# EasyEDA Pro project ProDocument_大功率降压DCDC_2023-12-31.epro

# Schematic Schematic12
Create Date: 2023-12-13; Page Name: P1; Project Name: Multimeter; Schematic Name: Schematic12; Update Date: 2023-12-13; Company: 嘉立创EDA; Page Size: A4; Version: V1.0
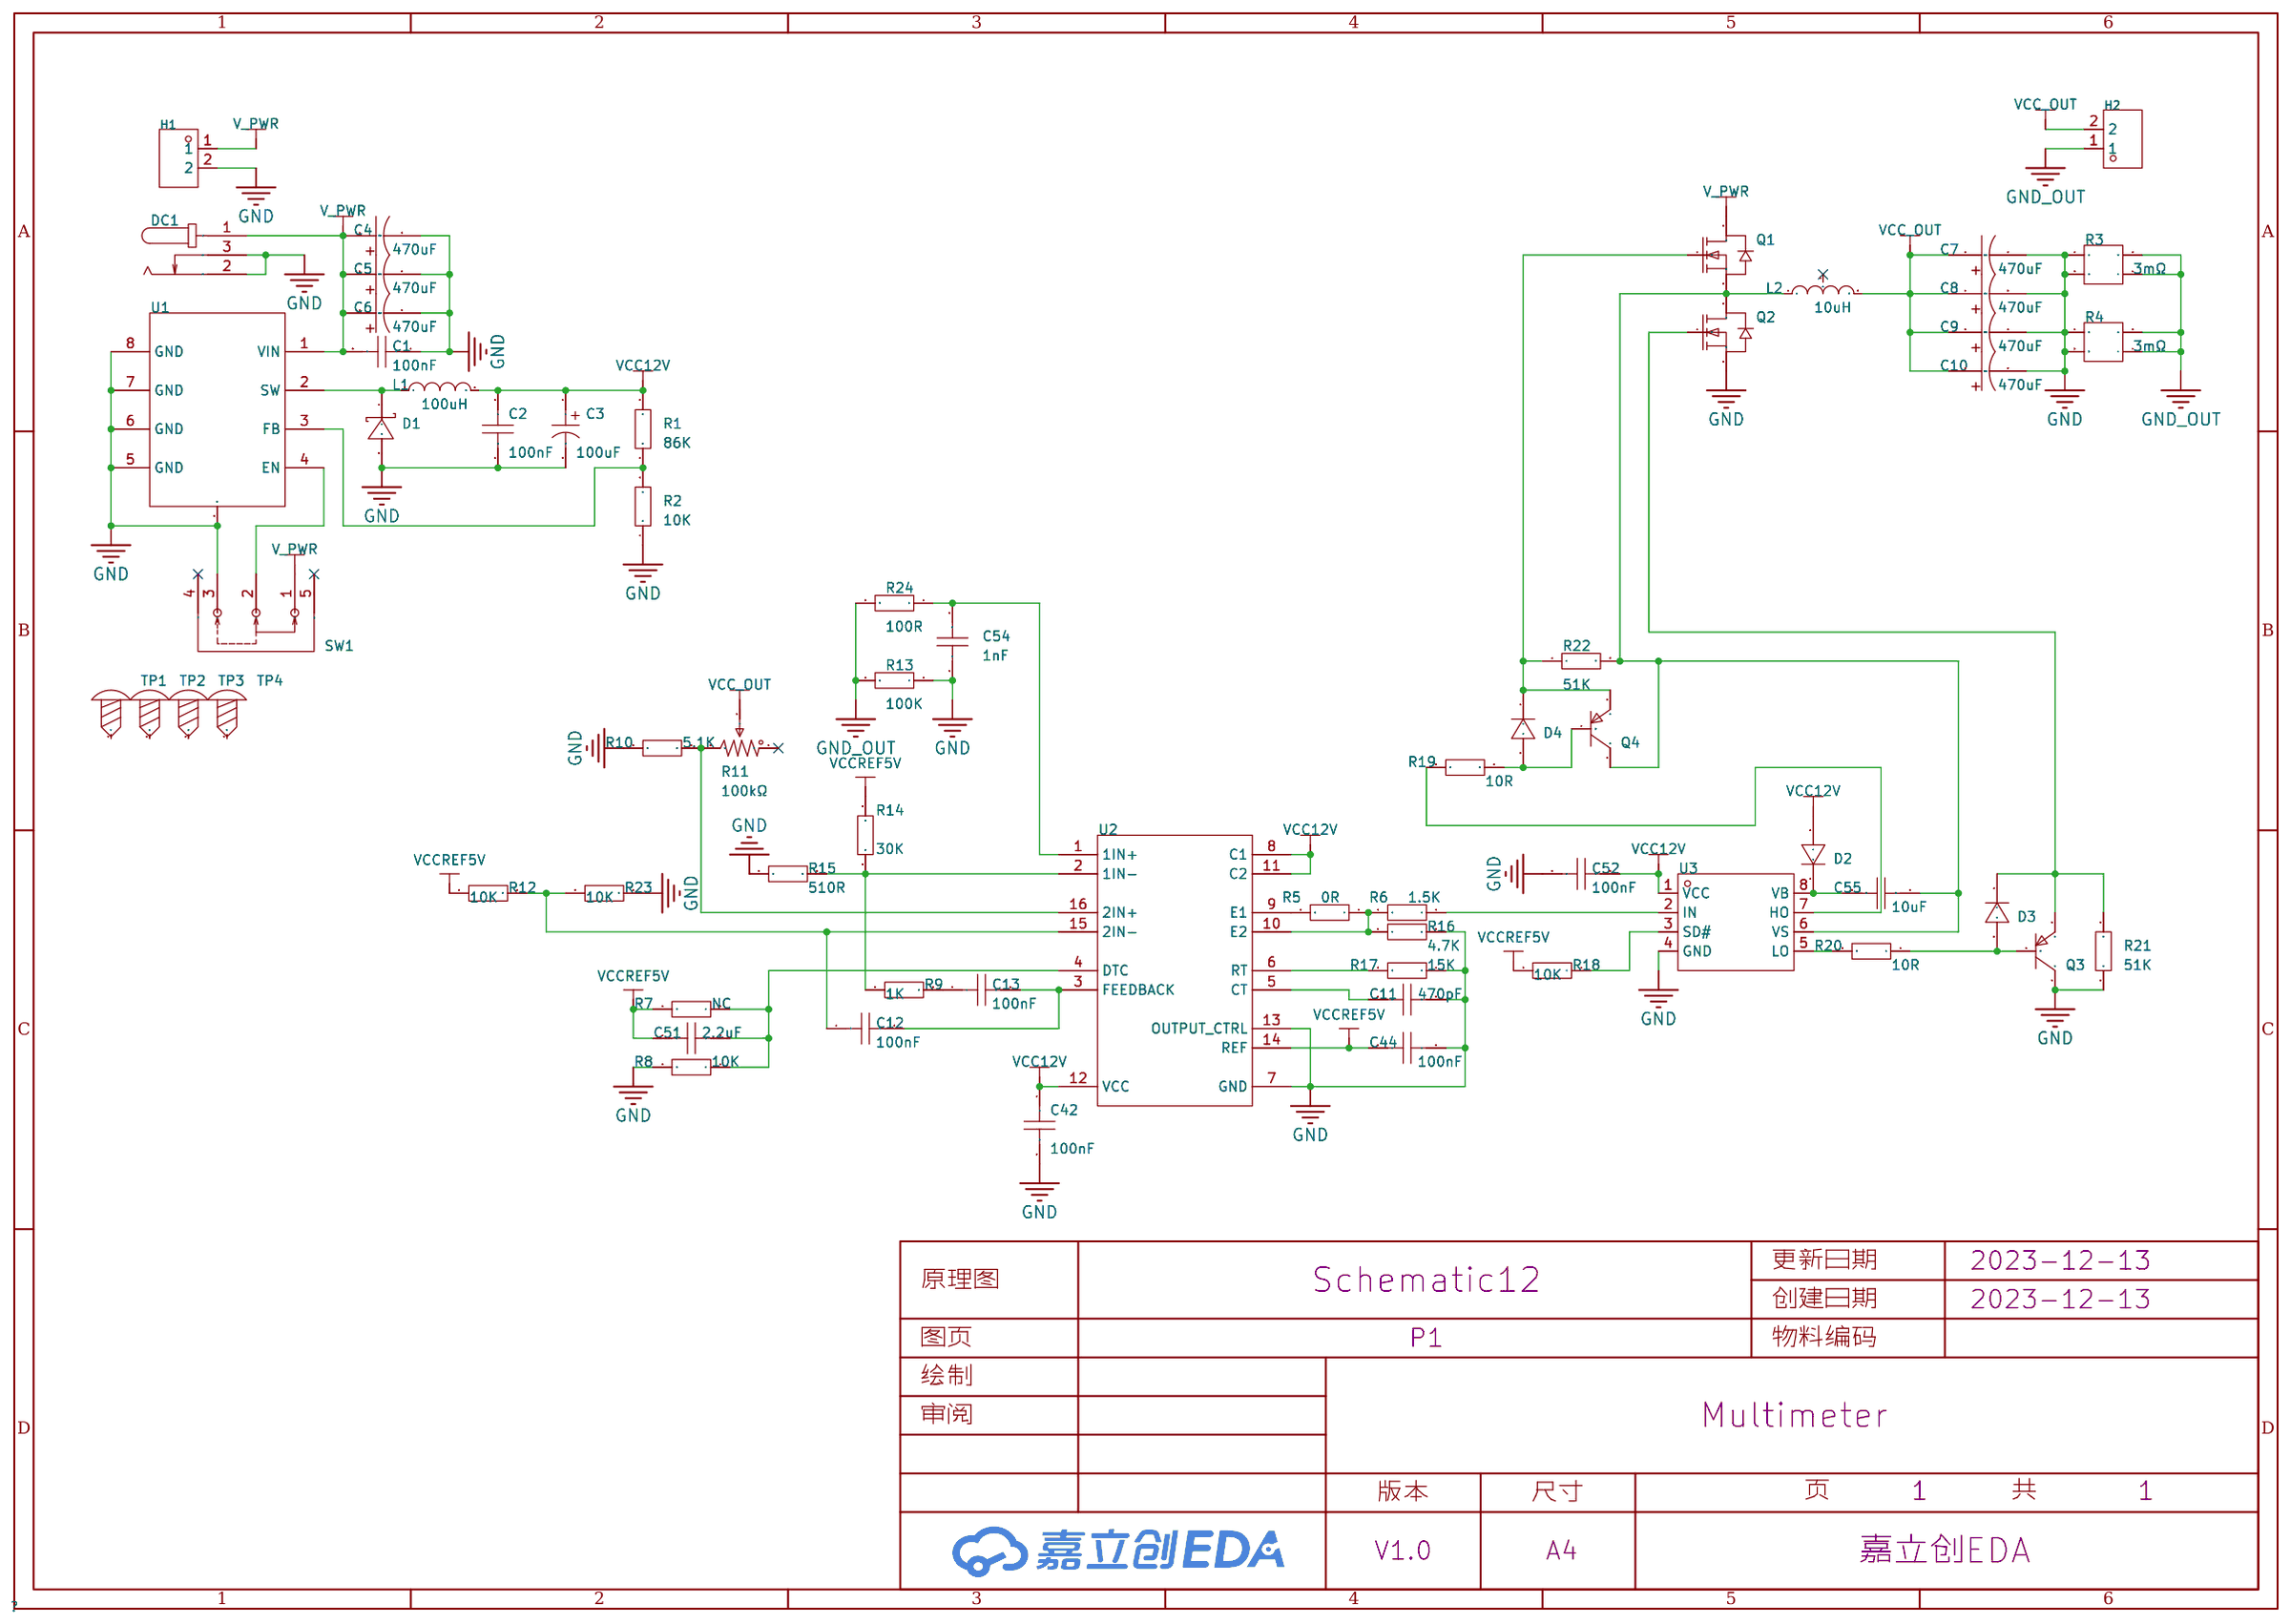
[diagram p0: schematic sheet]

## Parts
C1  100nF  [C0603]
C2  100nF  [C0603]
C3  100uF  [CAP-SMD_BD6.3-L6.6-W6.6-LS7.6-FD-1]
C4  470uF  [CAP-TH_BD16.0-P7.50-D1.2-FD]
C5  470uF  [CAP-TH_BD16.0-P7.50-D1.2-FD]
C6  470uF  [CAP-TH_BD16.0-P7.50-D1.2-FD]
C7  470uF  [CAP-TH_BD16.0-P7.50-D1.2-FD]
C8  470uF  [CAP-TH_BD16.0-P7.50-D1.2-FD]
C9  470uF  [CAP-TH_BD16.0-P7.50-D1.2-FD]
C10  470uF  [CAP-TH_BD16.0-P7.50-D1.2-FD]
C11  470pF  [C0603]
C12  100nF  [C0603]
C13  100nF  [C0603]
C42  100nF  [C0603]
C44  100nF  [C0603]
C51  2.2uF  [C0603]
C52  100nF  [C0603]
C54  1nF  [C0603]
C55  10uF  [C0603]
D1  SS210  [SMA_L4.3-W2.6-LS5.2-RD]
D2  1N4148W  [SOD-123_L2.8-W1.8-LS3.7-RD]
D3  1N4148W  [SOD-123_L2.8-W1.8-LS3.7-RD]
D4  1N4148W  [SOD-123_L2.8-W1.8-LS3.7-RD]
DC1  DC-005-20A  [DC-IN-TH_DC-005-20A]
H1  DBT50G-9.5-2P  [CONN-TH_2P-P9.50_DBT50G-9.5-2P]
H2  DBT50G-9.5-2P  [CONN-TH_2P-P9.50_DBT50G-9.5-2P]
L1  100uH  [IND-SMD_L7.1-W6.6]
L2  10uH  [IND-SMD_3P-L27.9-W19.7-P10.43-LS27.9-BL-A]
Q1  NCEP01T18T  [PG-TO247-3_L15.9-W5.2-P5.44-L]
Q2  NCEP01T18T  [PG-TO247-3_L15.9-W5.2-P5.44-L]
Q3  SS8550 Y2  [SOT-23-3_L2.9-W1.3-P1.90-LS2.4-BR]
Q4  SS8550 Y2  [SOT-23-3_L2.9-W1.3-P1.90-LS2.4-BR]
R1  86K  [R0603]
R2  10K  [R0603]
R3  3mΩ  [RES-TH_4P-L8.3-W5.3-P3.10-BL]
R4  3mΩ  [RES-TH_4P-L8.3-W5.3-P3.10-BL]
R5  0R  [R0603]
R6  1.5K  [R0603]
R7  NC  [R0603]
R8  10K  [R0603]
R9  1K  [R0603]
R10  5.1K  [R0603]
R11  100kΩ  [RES-ADJ-TH_3362P]
R12  10K  [R0603]
R13  100K  [R0603]
R14  30K  [R0603]
R15  510R  [R0603]
R16  4.7K  [R0603]
R17  15K  [R0603]
R18  10K  [R0603]
R19  10R  [R0603]
R20  10R  [R0603]
R21  51K  [R0603]
R22  51K  [R0603]
R23  10K  [R0603]
R24  100R  [R0603]
SW1  SK12D07VG4  [SW-TH_SK12D07VG4]
TP1  -  [M3螺丝]
TP2  -  [M3螺丝]
TP3  -  [M3螺丝]
TP4  -  [M3螺丝]
U1  XL7005A  [SOIC-8_L4.9-W3.9-P1.27-LS6.0-BL-EP3.1-1]
U2  TL494CDR  [SOIC-16_L9.9-W3.9-P1.27-LS6.0-BL]
U3  EG2104  [SOP-8_L5.0-W4.0-P1.27-LS6.2-BL]

## Library data of the parts
C1 C2 C11-C13 C42 C44 C51 C52 C54 = CAP_0603: Supplier Footprint: 0603
C3 = RVE100UF35V67RV0072: 容值:100uF;精度:±20%;额定电压:35V;纹波电流:230mA@120Hz;等效串联电阻:600mΩ@100kHz;; LCSC Part Name: 100uF ±20% 35V; Supplier Part: C2836437; Manufacturer: KNSCHA(科尼盛); Supplier Footprint: SMD,D6.3xL7.7mm; JLCPCB Part Class: 扩展库; Datasheet: https://atta.szlcsc.com/upload/public/pdf/source/20220719/B52EB46F8A1558448ED03D8B4CB3C24F.pdf; Supplier: LCSC; Tolerance: ±20%; Rated Voltage: 35V; Ripple Current: 230mA@120Hz; Equivalent Series Resistance(ESR): 600mΩ@100kHz; φD: 6.3mm; L: 7.7mm; Lifetime @ Temp: 2000hrs@105℃; Operating Temperature: -55℃~+105℃
C4-C10 = ERE1KM471L25OT: 容值:470uF;精度:±20%;额定电压:100V;纹波电流:-;等效串联电阻:-;; LCSC Part Name: 470uF ±20% 100V; Supplier Part: C383056; Manufacturer: AISHI(艾华集团); Supplier Footprint: 插件,D16xL25mm; JLCPCB Part Class: 扩展库; Datasheet: https://atta.szlcsc.com/upload/public/pdf/source/20190327/C383056_BE3B42F0D1B85E811CB3E018D2C8340B.pdf; Supplier: LCSC; Tolerance: ±20%; Rated Voltage: 100V; φD: 16mm; L: 25mm; Lead Spacing: 7.5mm; Lifetime @ Temp: 4000hrs@105℃
C55 = CC0603KRX7R9BB104: 容值:100nF;精度:±10%;额定电压:50V;材质(温度系数):X7R;; LCSC Part Name: 100nF ±10% 50V; Supplier Part: C14663; Manufacturer: YAGEO(国巨); Supplier Footprint: 0603; JLCPCB Part Class: Basic Part; Datasheet: https://atta.szlcsc.com/upload/public/pdf/source/20180910/C282072_33301C7F631E79921B82A8DAC6BCC5B3.pdf; Supplier: LCSC; Tolerance: ±10%; Voltage Rated: 50V; Temperature Coefficient: X7R
D1 = SS210_C14996: 直流反向耐压(Vr):100V;平均整流电流(Io):2A;正向压降(Vf):850mV@2A;; LCSC Part Name: 100V 2A 850mV@2A; Supplier Part: C14996; Manufacturer: MDD; Supplier Footprint: SMA(DO-214AC); JLCPCB Part Class: Basic Part; Datasheet: https://atta.szlcsc.com/upload/public/pdf/source/20190304/C14996_C9642665EC53B919CC87DB9E28DB3D1C.pdf; Supplier: LCSC; Reverse Voltage (Vr): 100V; Average Rectified Current (Io): 2A; Forward Voltage (Vf@If): 850mV@2A
D2-D4 = 1N4148W_C2099: 二极管配置:独立式;功率:500mW;直流反向耐压(Vr):100V;平均整流电流(Io):150mA;正向压降(Vf):1.25V@150mA;反向电流(Ir):1uA@75V;反向恢复时间(trr):4ns;工作温度:+150℃@(Tj);; LCSC Part Name: 100V 150mA 4ns T4; Supplier Part: C2099; Manufacturer: CJ(江苏长电/长晶); Supplier Footprint: SOD-123; JLCPCB Part Class: 扩展库; Datasheet: https://atta.szlcsc.com/upload/public/pdf/source/20120428/1457706480199.pdf; Supplier: LCSC; Diode Configuration: 独立式; Power Dissipation: 500mW; Reverse Voltage (Vr): 100V; Average Rectified Current (Io): 150mA; Forward Voltage (Vf@If): 1.25V@150mA; Reverse Leakage Current: 1uA@75V; Reverse Recovery Time (trr): 4ns; Operating Temperature: +150℃@(Tj)
DC1 = DC-005-20A_C136744: 触点内径:2mm;触点外径:6.4mm;额定电流:500mA;额定电压:30V;; LCSC Part Name: DC-005-20A  内芯2.0mm 全铜; Supplier Part: C136744; Manufacturer: 韩国韩荣; Supplier Footprint: 插件; JLCPCB Part Class: 扩展库; Datasheet: https://atta.szlcsc.com/upload/public/pdf/source/20210810/D1FE451D887B1804F0660F580C4AD849.pdf; Supplier: LCSC; Inside Contact Diameter: 2mm; Outside Contact Diameter: 6.4mm; Current Rating (Max): 500mA; Voltage Rating (Max): 30V
H1 H2 = DBT50G-9.5-2P: 隔板类型:带盖板;间距:9.5mm;结构:1x2P;每排PIN数:2;排数:1;安装方式:直针;引脚位置:边脚;额定电流:32A;额定电压:750V;线规 - AWG:12~22;线规 - mm2:4;工作温度范围:-40℃~+105℃;颜色:黑色;; LCSC Part Name: 9.5mm 1x2P 每排P数:2 排数:1 直针 边脚; Supplier Part: C395958; Manufacturer: DIBO(地博电气); Supplier Footprint: 插件,P=9.5mm; JLCPCB Part Class: 扩展库; Datasheet: https://atta.szlcsc.com/upload/public/pdf/source/20230619/13ADDB604F78DE06B1EFD4F82CE20A46.pdf; Supplier: LCSC; Barrier Type: 带盖板; Pitch: 9.5mm; Structure: 1x2P; Number of PINs Per Row: 2; Number of Rows: 1; Mounting Style: 直针; Pin Location: 边脚; Current Rating (Max): 32A; Voltage Rating (Max): 750V; Wire Gauge - AWG: 12~22; Wire Gauge - mm2: 4; Operating Temperature Range: -40℃~+105℃; Color: 黑色
L1 = SMMS0650-101M: 电感值:100uH;精度:±20%;额定电流:1.5A;饱和电流(Isat):2A;; LCSC Part Name: 100uH ±20% 1.5A 595mΩ; Supplier Part: C2894722; Manufacturer: SXN(顺翔诺); Supplier Footprint: SMD,6.6x7.1mm; JLCPCB Part Class: 扩展库; Datasheet: https://atta.szlcsc.com/upload/public/pdf/source/20210910/523B6BB0C4A09F37806A127B1ABE761D.pdf; Supplier: LCSC; Tolerance: ±20%; Rated Current: 1.5A; Saturation Current (Isat): 2A; DC Resistance (DCR): 595mΩ
L2 = FC-SE2918-100M-28A: 电感值:10uH;精度:±20%;额定电流:30A;类型:-;饱和电流(Isat):32.1A;; LCSC Part Name: 10uH ±20% 32.1A; Supplier Part: C3037600; Manufacturer: FC(方成); Supplier Footprint: SMD; JLCPCB Part Class: 扩展库; Datasheet: https://atta.szlcsc.com/upload/public/pdf/source/20230712/96DF22DB850A53D8EF9E65329083AA7B.pdf; Supplier: LCSC; Tolerance: ±20%; Rated Current: 30A; DC Resistance (DCR): 2.6mΩ; Saturation Current (Isat): 32.1A
Q1 Q2 = NCEP01T18T: 类型:N沟道;漏源电压(Vdss):100V;连续漏极电流(Id):180A;功率(Pd):300W;导通电阻(RDS(on)@Vgs,Id):3mΩ@10V,100A;阈值电压(Vgs(th)@Id):4.5V@250uA;栅极电荷(Qg@Vgs):158nC@10V;输入电容(Ciss@Vds):11.5nF@50V;反向传输电容(Crss@Vds):75pF@50V;工作温度:-55℃~+175℃@(Tj);; LCSC Part Name: N沟道 100V 180A; Supplier Part: C503016; Manufacturer: NCE(无锡新洁能); Supplier Footprint: TO-247; JLCPCB Part Class: 扩展库; Datasheet: https://atta.szlcsc.com/upload/public/pdf/source/20200413/C503016_3DD20AD2994103B3C8639D8235341B8B.pdf; Supplier: LCSC; Type: N沟道; Drain Source Voltage (Vdss): 100V; Continuous Drain Current (Id): 180A; Power Dissipation (Pd): 300W; Drain Source On Resistance (RDS(on)@Vgs,Id): 3mΩ@10V,100A; Gate Threshold Voltage (Vgs(th)@Id): 4.5V@250uA; Total Gate Charge (Qg@Vgs): 158nC@10V; Input Capacitance (Ciss@Vds): 11.5nF@50V; Reverse Transfer Capacitance (Crss@Vds): 75pF@50V; Operating Temperature: -55℃~+175℃@(Tj)
Q3 Q4 = SS8550 Y2_C8542: 晶体管类型:PNP;集电极电流(Ic):1.5A;集射极击穿电压(Vceo):25V;功率(Pd):300mW;直流电流增益(hFE@Ic,Vce):200@100mA,1V;; LCSC Part Name: 耐压:25V 电流:1.5A PNP hfe=200~350; Supplier Part: C8542; Manufacturer: CJ(江苏长电/长晶); Supplier Footprint: SOT-23; JLCPCB Part Class: 基础库; Datasheet: https://atta.szlcsc.com/upload/public/pdf/source/20140809/1457707214734.pdf; Supplier: LCSC; Transistor Type: PNP; Collector Current (Ic): 1.5A; Collector-Emitter Breakdown Voltage (Vceo): 25V; Power Dissipation (Pd): 300mW; DC Current Gain (hFE@Ic,Vce): 200@100mA,1V; Transition Frequency (fT): 100MHz; Collector Cut-Off Current (Icbo): 100nA; Collector-Emitter Saturation Voltage (VCE(sat)@Ic,Ib): 500mV@800mA,80mA; Operating Temperature: +150℃@(Tj)
R1 R2 R5-R10 R12-R24 = Res_0603: Supplier Footprint: 0603
R3 R4 = HOBH3820-5W-3mR-1%: 阻值:3mΩ;精度:±1%;功率:5W;; LCSC Part Name: 3mΩ ±1% 5W; Supplier Part: C481549; Manufacturer: Milliohm(毫欧); Supplier Footprint: 插件; JLCPCB Part Class: 扩展库; Datasheet: https://atta.szlcsc.com/upload/public/pdf/source/20200508/C481544_9E1628625E50F6AD0BCA73B5002EA05D.pdf; Supplier: LCSC; Tolerance: ±1%; Power(Watts): 5W; Temperature Coefficient: ±50ppm/℃
R11 = 3362P-1-104: 阻值:100kΩ;精度:±10%;; LCSC Part Name: 100kΩ ±10%; Supplier Part: C118966; Manufacturer: BOCHEN(博晨); Supplier Footprint: 插件; JLCPCB Part Class: 扩展库; Datasheet: https://atta.szlcsc.com/upload/public/pdf/source/20171114/C118966_15106326666201117452.pdf; Supplier: LCSC; Tolerance: ±10%
SW1 = SK12D07VG4: 电路结构:单刀双掷;安装方式:卧插;额定电流(DC):500mA;额定电压(DC):50V;额定电流(AC):-;额定电压(AC):-;机械寿命:5千次;; LCSC Part Name: 3脚2档位 卧插 滑动开关; Supplier Part: C393937; Manufacturer: SHOU HAN(首韩); Supplier Footprint: 插件; JLCPCB Part Class: 扩展库; Datasheet: https://atta.szlcsc.com/upload/public/pdf/source/20190521/C393937_939FE26E571CC67D2D532E953108A1B0.pdf; Supplier: LCSC; Circuit: 单刀双掷; Actuator Style: 矩形柱状; Pin Style: PC引脚; Switch Height: 8.8mm; Mounting Style: 卧插; Current Rating (DC): 500mA; Voltage Rating (DC): 50V; Mechanical Life: 5千次
TP1-TP4 = M3螺丝: Supplier Footprint: 插件
U1 = XL7005A: 功能类型:降压型;同步整流:-;输出通道数:-;拓扑结构:-;输入电压:-;输出电流(最大值):-;开关频率:-;; LCSC Part Name: 降压型; Supplier Part: C50848; Manufacturer: XLSEMI(芯龙); Supplier Footprint: SOP-8-EP-150mil; JLCPCB Part Class: 扩展库; Datasheet: https://atta.szlcsc.com/upload/public/pdf/source/20150821/1457707346919.pdf; Supplier: LCSC; Function: 降压型
U2 = TL494CDR: TL494 脉冲宽度调制 (Pwm) 控制电路; Supplier Part: C19882; Manufacturer: TI(德州仪器); Supplier Footprint: SOIC-16-150mil; JLCPCB Part Class: Extended Part; Datasheet: https://atta.szlcsc.com/upload/public/pdf/source/20170919/C19882_1505799671377977592.pdf; Supplier: LCSC
U3 = EG2104: 高性价比, 600V，半桥式Nmos预驱动器; Supplier Part: C186697; Manufacturer: EG(屹晶微); Supplier Footprint: SOP-8; JLCPCB Part Class: 扩展库; Datasheet: https://atta.szlcsc.com/upload/public/pdf/source/20220627/4CCFA0CAB664067FEE4AF87E4129127F.pdf; Supplier: LCSC

## Nets
GND: C1.1 C2.1 C3.2 C4.2 C5.2 C6.2 C7.2 C8.2 C9.2 C10.2 C11.2 C42.2 C44.2 C52.1 C54.1 D1.2(A) DC1.2 DC1.3 H1.2 Q2.3(S) Q3.3(C) R2.1 R3.1 R3.3 R4.1 R4.3 R8.2 R10.2 R13.1 R15.2 R16.1 R17.1 R21.2 R23.1 SW1.3 U1.5(GND) U1.6(GND) U1.7(GND) U1.8(GND) U1.9 U2.7(GND) U2.13(OUTPUT CTRL) U3.4(GND)
GND_OUT: H2.1 R3.2 R3.4 R4.2 R4.4 R13.2 R24.2
VCC12V: C2.2 C3.1 C42.1 C52.2 D2.2(A) L1.2 R1.2 U2.8(C1) U2.11(C2) U2.12(VCC) U3.1(VCC)
VCC_OUT: C7.1 C8.1 C9.1 C10.1 H2.2 L2.2 R11.2
VCCREF5V: C44.1 C51.1 R7.2 R12.2 R14.1 R18.2 U2.14(REF)
V_PWR: C1.2 C4.1 C5.1 C6.1 DC1.1 H1.1 Q1.2(D) SW1.1 U1.1(VIN)
$1N366: D1.1(K) L1.1 U1.2(SW)
$1N432: SW1.2 U1.4(EN)
$1N913: R1.1 R2.2 U1.3(FB)
$1N3166: R17.2 U2.6(RT)
$1N3167: C11.1 U2.5(CT)
$1N3287: R5.2 U2.9(E1)
$1N3291: R5.1 R6.2 R16.2 U2.10(E2)
$1N3419: C51.2 R7.1 R8.1 U2.4(DTC)
$1N3458: R10.1 R11.3 U2.16(2IN+)
$1N3546: R6.1 U3.2(IN)
$1N3585: R18.1 U3.3(SD#)
$1N3799: C12.1 R12.1 R23.2 U2.15(2IN-)
$1N3920: C54.2 R24.1 U2.1(1IN+)
$1N4058: C12.2 C13.2 U2.3(FEEDBACK)
$1N4096: R9.2 R14.2 R15.1 U2.2(1IN-)
$1N4130: C13.1 R9.1
$1N4223: C55.2 D2.1(K) U3.8(VB)
$1N4352: R20.2 U3.5(LO)
$1N4398: D3.2(A) Q3.1(B) R20.1
$1N4568: D3.1(K) Q2.1(G) Q3.2(E) R21.1
$1N4659: D4.2(A) Q4.1(B) R19.1
$1N4677: C55.1 L2.1 Q1.3(S) Q2.2(D) Q4.3(C) R22.2 U3.6(VS)
$1N4793: D4.1(K) Q1.1(G) Q4.2(E) R22.1
$1N4800: R19.2 U3.7(HO)

Not connected (* = marked no-connect by the designer): L2 3*; R11 1*; SW1 4* 5*; TP1 1; TP2 1; TP3 1; TP4 1

# Board PCB23
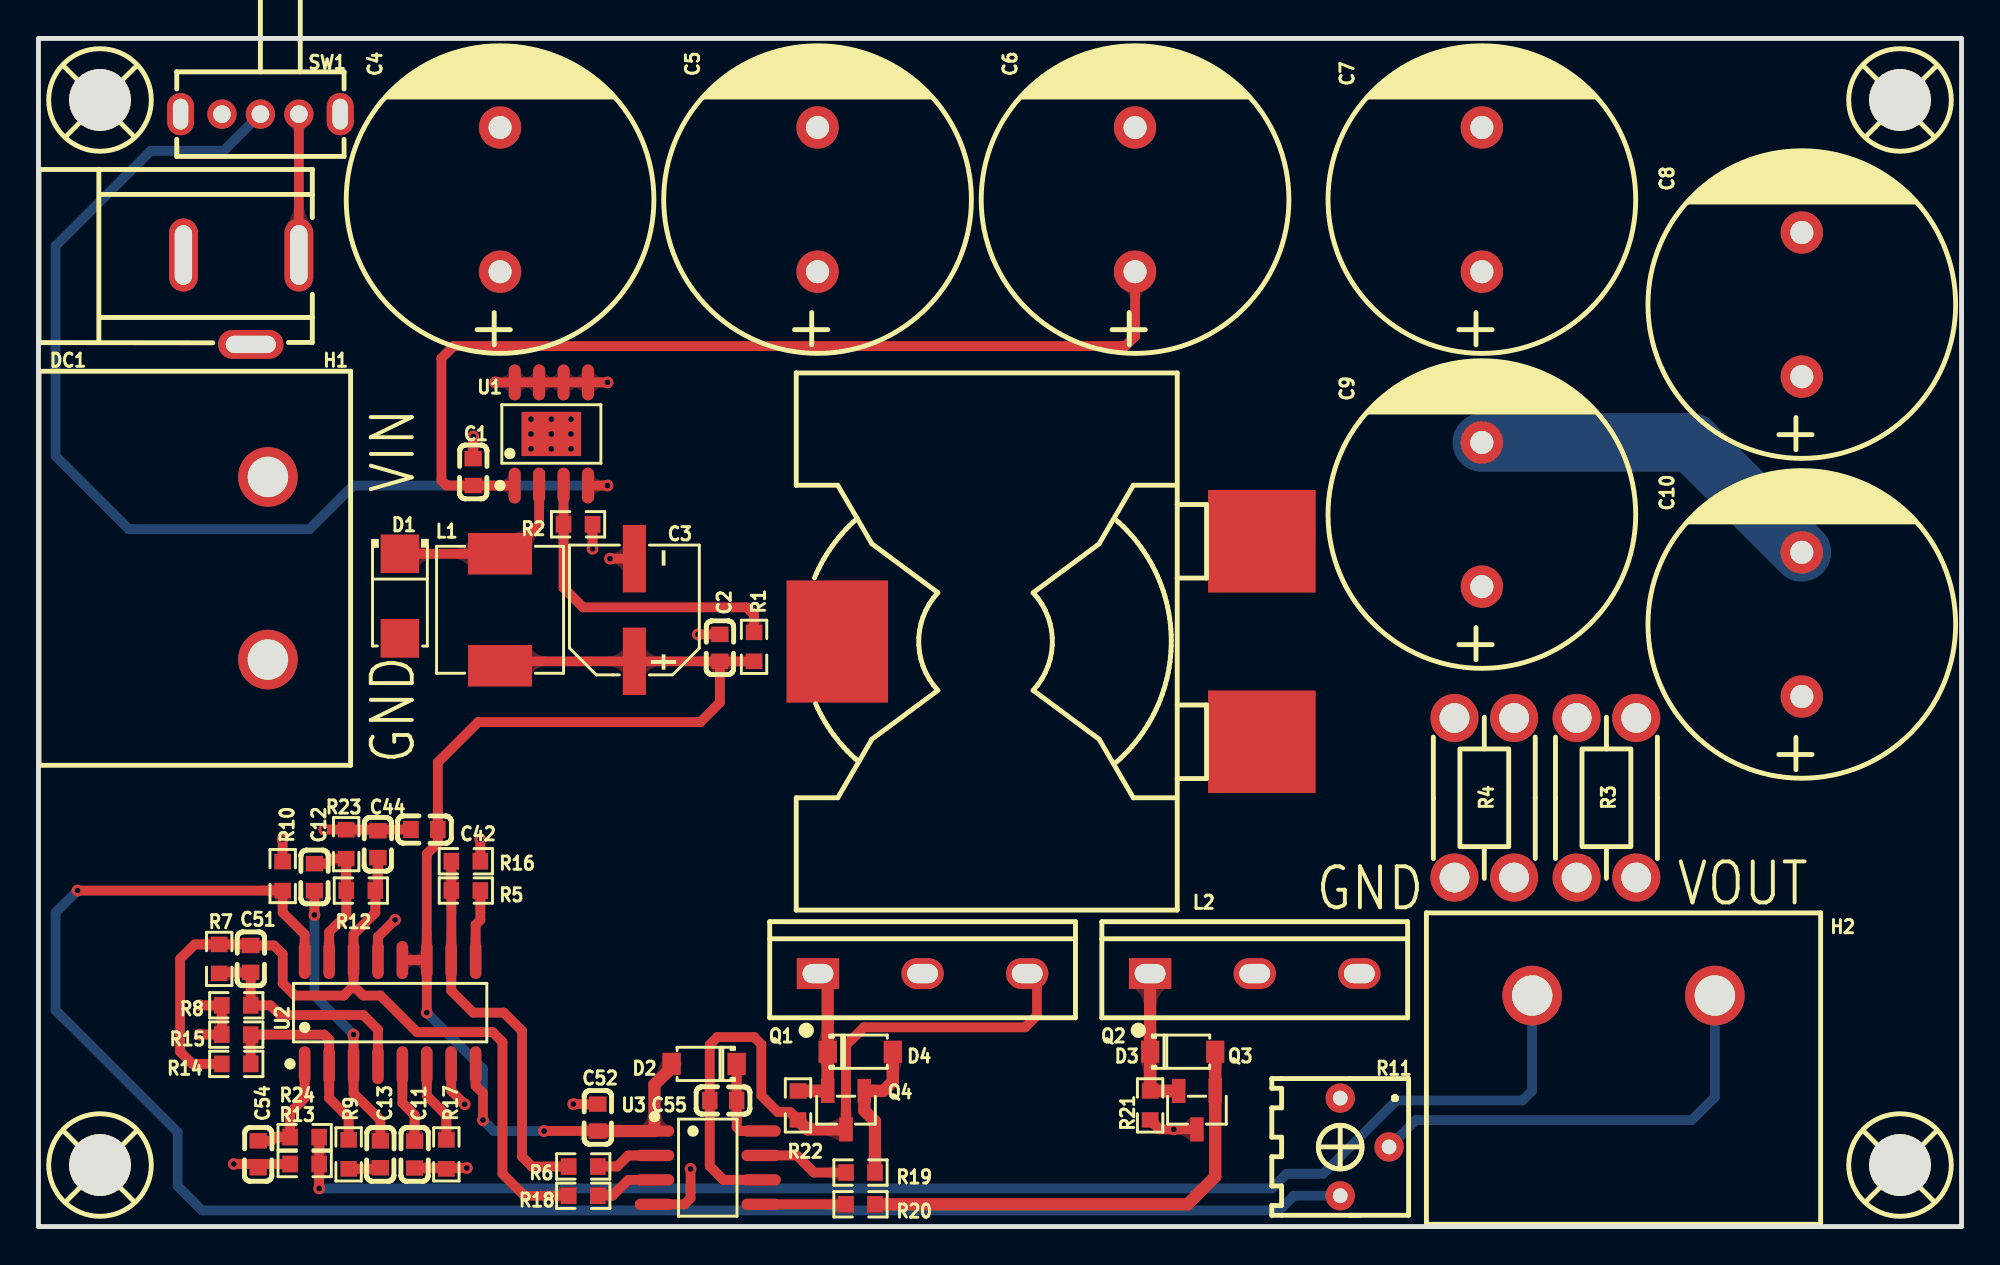
[diagram p1: board, top side]
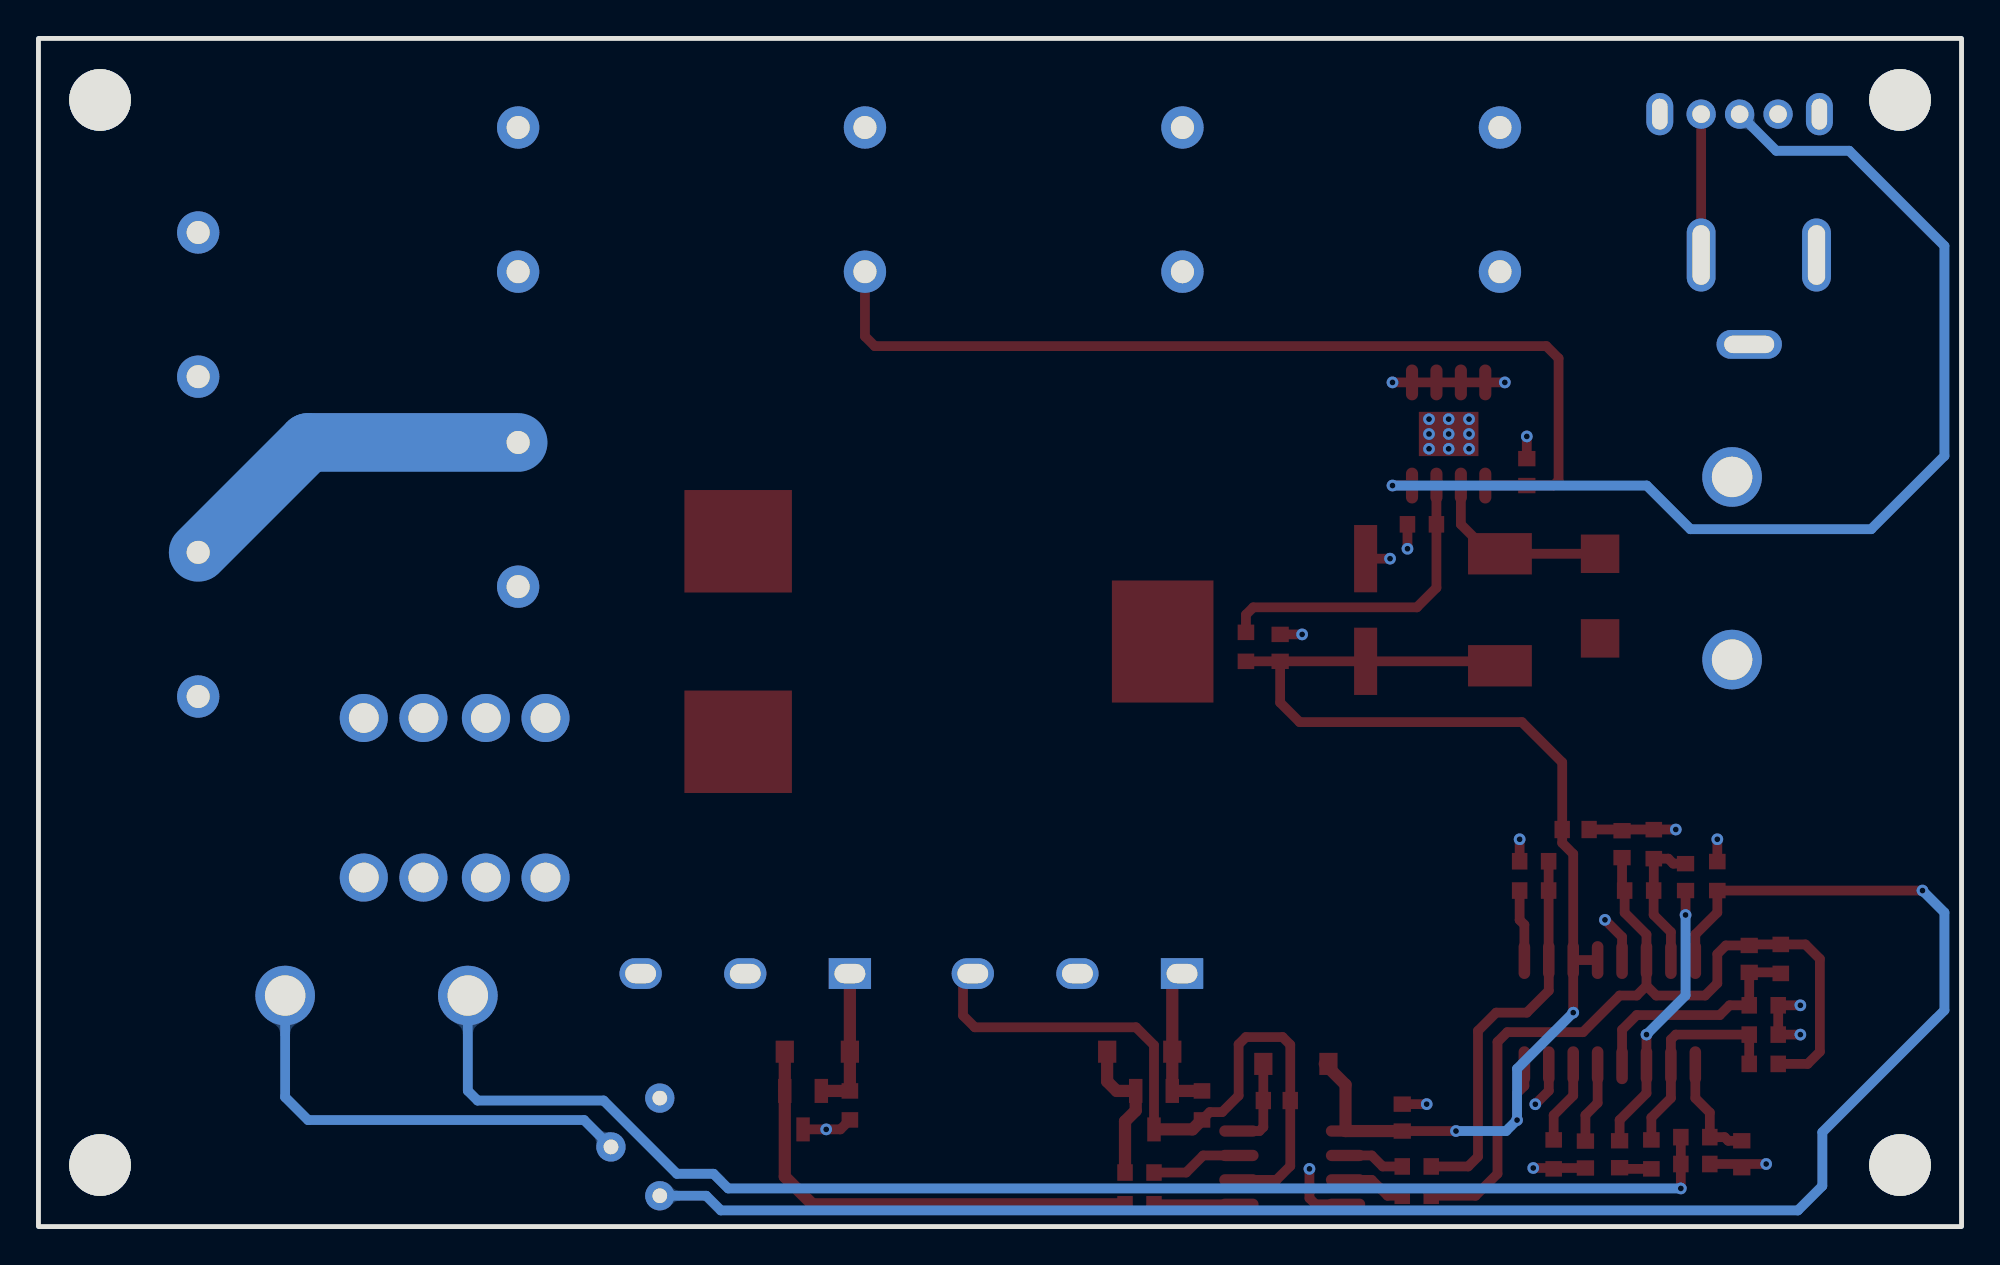
[diagram p2: board, bottom side, seen from below]

Outline 100 x 61.8 mm; copper layers: Top Layer, Bottom Layer. Coordinates in mm from the lower left corner of the outline.
Outline path: rectangle 0,61.8 100,0
Stack: Top Layer 0.035mm / Dielectric1 1.51mm FR4 er 4.5 / Bottom Layer 0.035mm

## Design rules (mm)
template: 自定义配置
spacing copperThickness1oz (default): track to track 0.102, other pairs 0.152 to 0.3
spacing copperThickness2oz: track to track 0.203, other pairs 0.152 to 0.3
track width copperThickness1oz (default): min 0.127, default 0.254, max 5.08
track width copperThickness2oz: min 0.203, default 0.254, max 2.54
differential pair differentialPair (default): width min 0.127, default 0.254, max 2.54; gap min 0.152, default 0.152
via viaSize (default): diameter min 0.5, default 0.61, max 10; hole min 0.3, default 0.305, max 6.299

## Placement (name value [footprint] x y rotation side)
C1  100nF  [C0603]  22.61 39.24 270 top
C2  100nF  [C0603]  35.43 30.1 270 top
C3  100uF  [CAP-SMD_BD6.3-L6.6-W6.6-LS7.6-FD-1]  30.99 32.07 90 top
C4  470uF  [CAP-TH_BD16.0-P7.50-D1.2-FD]  24 53.42 90 top
C5  470uF  [CAP-TH_BD16.0-P7.50-D1.2-FD]  40.51 53.42 90 top
C6  470uF  [CAP-TH_BD16.0-P7.50-D1.2-FD]  57.02 53.42 90 top
C7  470uF  [CAP-TH_BD16.0-P7.50-D1.2-FD]  75.06 53.42 90 top
C8  470uF  [CAP-TH_BD16.0-P7.50-D1.2-FD]  91.69 47.96 90 top
C9  470uF  [CAP-TH_BD16.0-P7.50-D1.2-FD]  75.06 37.04 90 top
C10  470uF  [CAP-TH_BD16.0-P7.50-D1.2-FD]  91.69 31.32 90 top
C11  470pF  [C0603]  19.56 3.75 270 top
C12  100nF  [C0603]  14.35 18.18 270 top
C13  100nF  [C0603]  17.78 3.76 90 top
C42  100nF  [C0603]  20.07 20.65 180 top
C44  100nF  [C0603]  17.65 19.89 90 top
C51  2.2uF  [C0603]  11.04 13.92 270 top
C52  100nF  [C0603]  29.08 5.67 270 top
C54  1nF  [C0603]  11.43 3.76 90 top
C55  10uF  [C0603]  35.61 6.56 0 top
D1  SS210  [SMA_L4.3-W2.6-LS5.2-RD]  18.8 32.8 270 top
D2  1N4148W  [SOD-123_L2.8-W1.8-LS3.7-RD]  34.61 8.46 180 top
D3  1N4148W  [SOD-123_L2.8-W1.8-LS3.7-RD]  59.5 9.1 0 top
D4  1N4148W  [SOD-123_L2.8-W1.8-LS3.7-RD]  42.73 9.1 0 top
DC1  DC-005-20A  [DC-IN-TH_DC-005-20A]  10.54 48.21 0 top
H1  DBT50G-9.5-2P  [CONN-TH_2P-P9.50_DBT50G-9.5-2P]  11.93 34.24 270 top
H2  DBT50G-9.5-2P  [CONN-TH_2P-P9.50_DBT50G-9.5-2P]  82.42 12.02 0 top
L1  100uH  [IND-SMD_L7.1-W6.6]  24 32.08 270 top
L2  10uH  [IND-SMD_3P-L27.9-W19.7-P10.43-LS27.9-BL-A]  52.58 30.43 90 top
Q1  NCEP01T18T  [PG-TO247-3_L15.9-W5.2-P5.44-L]  45.97 13.16 0 top
Q2  NCEP01T18T  [PG-TO247-3_L15.9-W5.2-P5.44-L]  63.25 13.16 0 top
Q3  SS8550 Y2  [SOT-23-3_L2.9-W1.3-P1.90-LS2.4-BR]  60.24 6.05 90 top
Q4  SS8550 Y2  [SOT-23-3_L2.9-W1.3-P1.90-LS2.4-BR]  41.99 6.05 90 top
R1  86K  [R0603]  37.21 30.15 270 top
R2  10K  [R0603]  28.06 36.53 180 top
R3  3mΩ  [RES-TH_4P-L8.3-W5.3-P3.10-BL]  81.53 22.3 270 top
R4  3mΩ  [RES-TH_4P-L8.3-W5.3-P3.10-BL]  75.18 22.3 270 top
R5  0R  [R0603]  22.22 17.48 0 top
R6  1.5K  [R0603]  28.33 3.13 180 top
R7  NC  [R0603]  9.4 13.92 90 top
R8  10K  [R0603]  10.29 11.51 180 top
R9  1K  [R0603]  16.13 3.75 90 top
R10  5.1K  [R0603]  12.7 18.23 90 top
R11  100kΩ  [RES-ADJ-TH_3362P]  68.96 4.14 270 top
R12  10K  [R0603]  16.76 17.48 0 top
R13  100K  [R0603]  13.84 3.25 0 top
R14  30K  [R0603]  10.29 8.46 0 top
R15  510R  [R0603]  10.29 9.98 180 top
R16  4.7K  [R0603]  22.22 19 180 top
R17  15K  [R0603]  21.21 3.75 90 top
R18  10K  [R0603]  28.33 1.6 180 top
R19  10R  [R0603]  42.75 2.81 180 top
R20  10R  [R0603]  42.75 1.16 180 top
R21  51K  [R0603]  57.81 6.3 270 top
R22  51K  [R0603]  39.5 6.3 270 top
R23  10K  [R0603]  16 19.89 270 top
R24  100R  [R0603]  13.84 4.65 0 top
SW1  SK12D07VG4  [SW-TH_SK12D07VG4]  11.54 57.86 180 top
TP1  -  [M3螺丝]  3.26 58.54 0 top
TP2  -  [M3螺丝]  3.26 3.14 0 top
TP3  -  [M3螺丝]  96.86 58.54 0 top
TP4  -  [M3螺丝]  96.86 3.14 0 top
U1  XL7005A  [SOIC-8_L4.9-W3.9-P1.27-LS6.0-BL-EP3.1-1]  26.67 41.23 0 top
U2  TL494CDR  [SOIC-16_L9.9-W3.9-P1.27-LS6.0-BL]  18.29 11.13 0 top
U3  EG2104  [SOIC-8_L4.9-W3.9-P1.27-LS6.0-BL]  34.8 3.06 270 top

## Footprints (pads in the part's own frame, mm; a bottom-side part is the same pattern mirrored in y, then rotated)
C0603
  rect 0.8x0.9 smd: 1(-0.7,0) 2(0.7,0)
CAP-SMD_BD6.3-L6.6-W6.6-LS7.6-FD-1
  rect 3.5x1.2 smd: 1(-2.67,0) 2(2.67,0)
CAP-TH_BD16.0-P7.50-D1.2-FD
  round 2.2 hole 1.2: 1(-3.75,0) 2(3.75,0)
CONN-TH_2P-P9.50_DBT50G-9.5-2P
  round 3.1 hole 2.1: 1(-4.75,0) 2(4.75,0)
DC-IN-TH_DC-005-20A
  oval 1.5x3.8 hole 0.9x3.1: 1(3,2.325) 2(-3,2.325)
  oval 3.4x1.5 hole 2.6x0.9: 3(0.5,-2.325)
IND-SMD_3P-L27.9-W19.7-P10.43-LS27.9-BL-A
  rect 5.33x5.59 smd: 1(-5.215,-11.037) 2(5.215,-11.037)
  rect 6.35x5.28 smd: 3(0,11.037)
IND-SMD_L7.1-W6.6
  rect 2.15x3.32 smd: 1(-2.913,0) 2(2.913,0)
M3螺丝
  round 3.2 hole 3.2: 1(-0.064,0.064)
PG-TO247-3_L15.9-W5.2-P5.44-L
  rect 2.2x1.6 hole 1.6x1: 1(-5.44,0)
  oval 2.2x1.6 hole 1.6x1: 2(0,0) 3(5.44,0)
R0603
  rect 0.806x0.864 smd: 1(-0.753,0) 2(0.753,0)
RES-ADJ-TH_3362P
  round 1.524 hole 0.762: 1(-2.54,-1.27) 2(0,1.27) 3(2.54,-1.27)
RES-TH_4P-L8.3-W5.3-P3.10-BL
  round 2.5 hole 1.55: 1(-4.15,-1.55) 2(4.15,-1.55) 3(-4.15,1.55) 4(4.15,1.55)
SMA_L4.3-W2.6-LS5.2-RD
  rect 2x2 smd: 1(-2.2,0) 2(2.2,0)
SOD-123_L2.8-W1.8-LS3.7-RD
  rect 0.95x1.15 smd: 1(-1.692,0) 2(1.692,0)
SOIC-8_L4.9-W3.9-P1.27-LS6.0-BL
  oval 0.588x2.045 smd: 1(-1.905,-2.772) 2(-0.635,-2.772) 3(0.635,-2.772) 4(1.905,-2.772) 5(1.905,2.772) 6(0.635,2.772) 7(-0.635,2.772) 8(-1.905,2.772)
SOIC-8_L4.9-W3.9-P1.27-LS6.0-BL-EP3.1-1
  oval 0.63x1.865 smd: 1(-1.905,-2.683) 2(-0.635,-2.683) 3(0.635,-2.683) 4(1.905,-2.683) 5(1.905,2.683) 6(0.635,2.683) 7(-0.635,2.683) 8(-1.905,2.683)
  rect 3.1x2.3 smd: 9(0,0)
SOIC-16_L9.9-W3.9-P1.27-LS6.0-BL
  oval 0.602x1.971 smd: 1(-4.445,-2.736) 2(-3.175,-2.736) 3(-1.905,-2.736) 4(-0.635,-2.736) 5(0.635,-2.736) 6(1.905,-2.736) 7(3.175,-2.736) 8(4.445,-2.736) 9(4.445,2.736) 10(3.175,2.736) 11(1.905,2.736) 12(0.635,2.736) 13(-0.635,2.736) 14(-1.905,2.736) 15(-3.175,2.736) 16(-4.445,2.736)
SOT-23-3_L2.9-W1.3-P1.90-LS2.4-BR
  rect 1.25x0.7 smd: 1(1,-0.95) 2(1,0.95) 3(-1,0)
SW-TH_SK12D07VG4
  round 1.524 hole 0.914: 1(-2,0) 2(0,0) 3(2,0)
  oval 1.4x2.2 hole 0.8x1.6: 4(4.15,0) 5(-4.15,0)

## Nets
As in the schematic.

Pads without a net: L2 3; R11 1; SW1 4 5; TP1 1; TP2 1; TP3 1; TP4 1

## Via types
v1: diameter 0.61, hole 0.305, Top Layer to Bottom Layer, 35 vias

## Routing (per net, layer and track width the routed paths; a pad name or vN(x,y) marks a point on that pad's centre or on a via; arc(x,y) is an arc through that point)
GND: length 58.2
  Top Layer w0.508: v1(22.16,6.36) 21.46,7.06 U2.7 ; R10.2 v1(12.7,20.14) ; v1(8.38,9.98) R15.2 R8.2 v1(8.38,11.51) ; U3.4 33.59,1.16 33.91,1.48 v1(33.91,3) ; R16.1 v1(22.98,20.14) ; v1(23.75,43.91) U1.8 U1.7 U1.6 U1.5 v1(29.59,43.91) ; C42.2 v1(14.86,20.65) ; C1.1 v1(22.61,41.1) ; Q3.3 v1(59.04,5.05) 58.3,5.05 R21.2 ; R2.1 v1(28.81,35.26) ; C52.1 v1(27.81,6.37) ; R13.1 v1(10.16,3.25) ; C3.2 v1(29.72,34.74) ; v1(18.54,15.95) 17.65,15.06 U2.13 ; C2.1 v1(34.29,30.8) ; C11.2 v1(22.27,3.05)
  Bottom Layer w3.048: C9.2 85.98,40.79 C10.2
  vias: v1(25.61,42) v1(25.61,41.23) v1(25.61,40.45) v1(26.67,42) v1(26.67,41.23) v1(26.67,40.45) v1(27.69,42) v1(27.69,41.23) v1(27.69,40.45)
GND_OUT: length 72.8
  Top Layer w0.508: R24.2 R13.2 v1(14.6,1.98)
  Bottom Layer w0.508: H2.1 77.67,7.06 77.16,6.56 70.61,6.56 66.8,2.75 64.9,2.75 64.13,1.98 v1(14.6,1.98)
VCC12V: length 68.8
  Top Layer w0.508: R1.2 C2.2 ; C2.2 35.43,27.26 34.42,26.24 22.86,26.24 20.77,24.15 C42.1 20.77,19.96 20.19,19.38 U2.11 ; C2.2 C3.1 24.23,29.4 L1.2 ; U2.11 U2.12 ; U2.11 v1(20.19,11.13) ; U2.8 22.73,7.32 23.11,6.94 v1(23.11,5.54) ; v1(26.29,4.97) C52.2
  Top Layer w0.635: C52.2 U3.1 32.03,7.38 33.11,8.46
  Bottom Layer w0.508: v1(26.29,4.97) 23.69,4.97 v1(23.11,5.54) 23.11,8.21 v1(20.19,11.13)
VCC_OUT: length 23.3
  Bottom Layer w0.508: H2.2 87.17,6.73 85.98,5.54 71.63,5.54 R11.2
VCCREF5V: length 45.7
  Top Layer w0.508: 16.38,12.52 16.89,12.02 17.78,12.02 19.69,10.11 23.62,10.11 24.13,9.6 24.13,2.75 25.27,1.6 R18.2 ; 16.38,12.52 U2.14 16.38,15.19 17.52,16.33 R12.2 17.65,17.61 C44.1 ; 16.38,12.52 15.88,12.02 13.33,12.02 12.7,12.65 12.7,14.18 12.25,14.62 C51.1 10.99,14.67 R7.2 8.12,14.67 7.37,13.92 7.37,9.1 8,8.46 R14.1
V_PWR: length 57.5
  Top Layer w0.508: C6.1 57.02,46.31 56.51,45.8 21.59,45.8 20.95,45.16 20.95,38.81 21.22,38.54 C1.2 U1.1 ; SW1.1 DC1.1
$1N366: length 9.9
  Top Layer w0.508: D1.1 L1.1 24.5,35 26.03,36.53 U1.2
$1N432: length 56.7
  Top Layer w0.508: U1.4 v1(29.59,38.54)
  Bottom Layer w0.508: SW1.2 9.64,55.96 5.84,55.96 0.89,51.01 0.89,40.08 4.7,36.27 14.1,36.27 16.37,38.54 v1(29.59,38.54)
$1N913: length 16.7
  Top Layer w0.508: U1.3 R2.2 27.31,33.23 28.32,32.21 36.83,32.21 37.21,31.83 R1.1
$1N3166: length 4.3
  Top Layer w0.508: U2.6 20.19,6.81 21.21,5.79 21.21,4.51
$1N3167: length 4.2
  Top Layer w0.508: U2.5 18.92,6.43 19.56,5.79 C11.1
$1N3287: length 3.7
  Top Layer w0.508: U2.9 22.73,15.7 22.98,15.94 R5.2
$1N3291: length 20.5
  Top Layer w0.508: R16.2 R5.1 21.47,13.87 U2.10 21.46,12.27 22.61,11.13 24.2,11.13 25.15,10.18 25.15,3.63 25.65,3.13 R6.2
$1N3419: length 12.4
  Top Layer w0.508: U2.4 17.65,10.24 16.89,11 12.57,11 12.06,11.51 R8.1 C51.2 9.45,13.22 R7.1
$1N3458: length 94.5
  Top Layer w0.508: 13.84,13.86 13.84,15.19 12.7,16.33 R10.1 v1(2.03,17.48)
  Bottom Layer w0.508: v1(2.03,17.48) 0.89,16.33 0.89,11.25 7.24,4.9 7.24,2.11 8.51,0.84 64.52,0.84 65.28,1.6 R11.3
$1N3546: length 3.2
  Top Layer w0.508: U3.2 30.67,3.7 30.1,3.13 R6.1
$1N3585: length 3.3
  Top Layer w0.508: U3.3 30.67,2.43 29.84,1.6 R18.1
$1N3799: length 7.4
  Top Layer w0.508: C12.1 14.99,18.88 15.25,19.14 R23.2 16,17.49 R12.1 16.01,16.22 15.11,15.32 U2.15
$1N3920: length 5.8
  Top Layer w0.508: 11.43,4.46 12.13,4.46 12.32,4.65 R24.1 13.09,5.93 13.84,6.68 13.84,8.39
$1N4058: length 14.4
  Top Layer w0.508: 17.78,4.46 17.78,5.54 16.38,6.94 U2.3 v1(16.38,9.98) ; v1(14.35,16.21) C12.2
  Bottom Layer w0.508: v1(14.35,16.21) 14.35,12.02 v1(16.38,9.98)
$1N4096: length 11.3
  Top Layer w0.508: R14.2 R15.1 14.86,9.98 15.11,9.73 U2.2 15.11,6.68 16.13,5.67 16.13,4.51
$1N4130: length 1.7
  Top Layer w0.508: R9.1 17.72,3 17.78,3.06
$1N4223: length 4.6
  Top Layer w0.508: D2.1 C55.2 36.31,5.17 36.51,4.97 U3.8
$1N4352: length 4.4
  Top Layer w0.508: U3.5 R20.2
$1N4398: length 24.8
  Top Layer w0.635: R20.1 59.75,1.16 61.19,2.59 Q3.1 D3.2
$1N4568: length 7.6
  Top Layer w0.635: Q3.2 R21.1 D3.1 Q2.1
$1N4659: length 7.7
  Top Layer w0.635: R19.1 43.5,5.47 42.94,6.03 Q4.1 43.93,7.05 44.43,7.55 D4.2
$1N4677: length 37.2
  Top Layer w0.508: Q4.3 41.99,9.43 42.93,10.37 51.31,10.37 51.92,10.98 51.92,13.16 ; R22.2 39.09,5.95 38.45,5.95 37.59,6.81 37.59,9.48 37.21,9.86 35.31,9.86 34.91,9.46 C55.1 34.91,3.14 35.62,2.43 U3.6
  Top Layer w0.635: R22.2 39.99,5.05 Q4.3
$1N4793: length 7.6
  Top Layer w0.635: R22.1 Q4.2 D4.1 41.04,13.16
$1N4800: length 4.8
  Top Layer w0.508: R19.2 40.32,2.81 39.43,3.7 U3.7

## Copper pours and planes (outline as drawn; the poured copper is in the pictures)
GND on Top Layer: 19.94,32.46 20.57,31.83 20.57,25.22 19.94,24.59 19.94,20.27 19.69,20.02 13.72,20.02 13.46,19.76 13.46,18.75 13.21,18.49 4.19,18.49 1.4,21.29 1.4,31.19 2.67,32.46
GND on Bottom Layer: 101.22,64.21 103.89,61.55 103.89,0.97 100.97,-1.95 0.38,-1.95 -1.65,0.08 -1.65,61.42 1.14,64.21
GND_OUT on Top Layer: 73.66,20.65 83.31,20.65 84.71,19.26 84.71,15.83 82.93,14.05 82.93,10.62 81.03,8.71 74.55,8.71 72.14,11.13 72.14,19.13
GND_OUT on Bottom Layer: 72.52,20.27 84.07,20.27 84.84,19.51 84.84,15.57 79.25,9.98 75.56,9.98 71.75,13.79 71.75,19.51
VCC12V on Top Layer: 31.62,31.45 32.96,30.11 36.14,30.11 36.32,29.92 36.32,28.78 36.07,28.53 33.02,28.53 31.75,27.26 22.1,27.26 21.59,27.76 21.59,30.94 22.1,31.45
VCC_OUT on Top Layer: 82.68,31.45 85.34,28.78 85.34,15.19 83.57,13.41 83.57,10.62 84.96,9.22 95.88,9.22 99.19,12.52 99.19,50.37 94.23,55.32 72.14,55.32 59.69,42.88 59.69,32.59 60.83,31.45
VCC_OUT on Bottom Layer: 74.17,51.77 73.28,50.88 73.28,46.69 74.42,45.54 79.25,45.54 80.39,44.4 80.39,37.67 79.12,36.4 74.17,36.4 73.28,35.51 73.28,32.34 73.91,31.7 84.96,31.7 88.14,28.53 88.14,17.99 83.57,13.41 83.57,10.62 84.58,9.6 95.88,9.6 99.31,13.03 99.31,48.08 98.17,49.23 88.65,49.23 86.11,51.77
V_PWR on Top Layer: 56.77,55.58 58.67,53.67 58.67,47.45 58.17,46.94 18.29,46.94 16.76,45.42 16.76,37.54 15.11,35.89 3.81,35.89 1.4,38.31 1.4,52.15 4.83,55.58
V_PWR on Bottom Layer: 58.04,51.89 39.12,51.89 37.59,50.37 37.59,21.29 42.54,16.33 42.54,12.14 43.81,10.87 49.15,10.87 50.42,12.14 50.42,14.94 59.44,23.95 59.44,50.5
$1N4677 on Top Layer: 50.16,30.3 67.82,30.3 70.23,27.89 70.23,19.26 66.68,15.7 66.68,12.4 65.79,11.51 61.09,11.51 60.2,12.4 60.2,13.92 59.69,14.43 54.99,14.43 54.48,13.92 54.48,12.4 53.59,11.51 49.4,11.51 48.51,12.4 48.51,28.65

Small or netless copper shapes (teardrops, artwork), in the pictures only: 169 on Top Layer, 6 on Bottom Layer

## Text on the board
Top Silkscreen Layer: VIN | GND | VOUT
